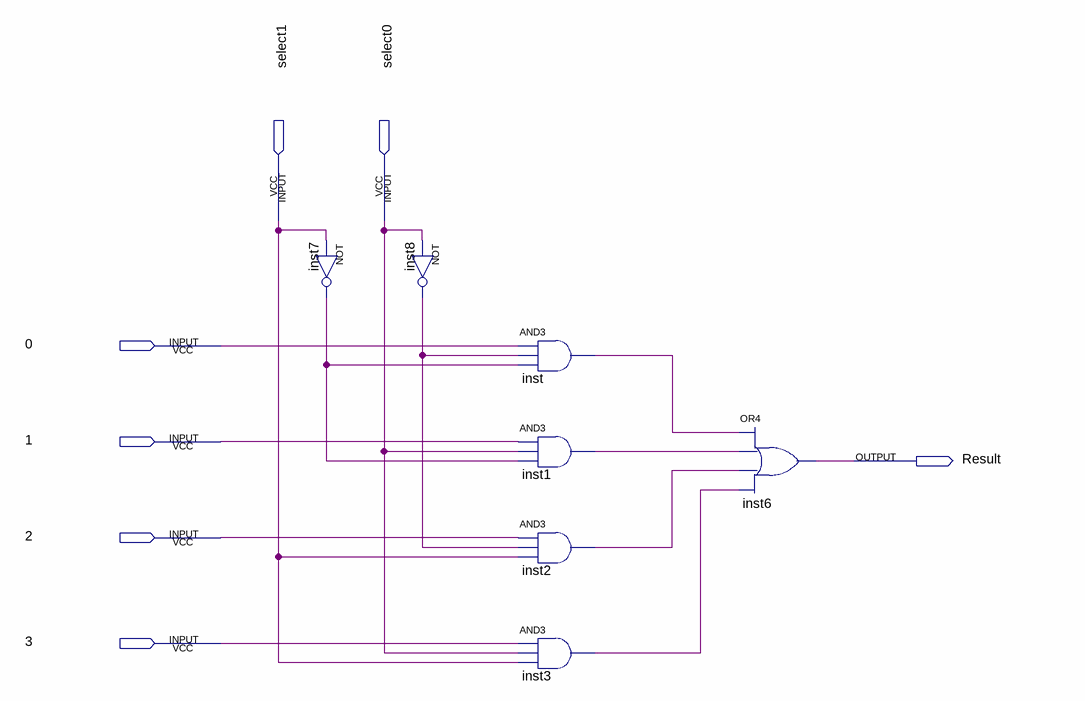
[diagram p0: schematic sheet]
// Quartus schematic ALUmux.bdf as structural Verilog: 7 symbols, 7 pins
module ALUmux (
  input  select1,
  input  select0,
  input  \0 ,
  input  \1 ,
  input  \2 ,
  input  \3 ,
  output Result
);

  wire inst1_out, inst2_out, inst3_out, inst7_out, inst8_out, inst_out;

  not inst7 (inst7_out, select1);
  not inst8 (inst8_out, select0);
  and inst (inst_out, \0 , inst8_out, inst7_out);
  and inst1 (inst1_out, \1 , select0, inst7_out);
  and inst2 (inst2_out, \2 , inst8_out, select1);
  and inst3 (inst3_out, \3 , select0, select1);
  or inst6 (Result, inst_out, inst1_out, inst2_out, inst3_out);
endmodule
